# Altium schematic sheet USB Downstream Type C Port 1.SchDoc: DO NOT FILL THIS IN
size Tabloid; Date: DO NOT FILL THIS IN; ApprovedBy: DO NOT FILL THIS IN; CheckedBy: DO NOT FILL THIS IN; Author: DO NOT FILL THIS IN; CompanyName: DO NOT FILL THIS IN; DrawnBy: DO NOT FILL THIS IN; Engineer: DO NOT FILL THIS IN; Organization: DO NOT FILL THIS IN; Address1: DO NOT FILL THIS IN; Address2: DO NOT FILL THIS IN; Address3: DO NOT FILL THIS IN; Address4: DO NOT FILL THIS IN; DocumentNumber: DO NOT FILL THIS IN; Revision: DO NOT FILL THIS IN; SheetNumber: 5; SheetTotal: 9; PageSetup: Record=PageOptions|CenterHorizontal=True|CenterVertical=True|PrintScale=1.00|XCorrection=1.00|YCorrection=1.00|PrintKind=1|BorderSize=5000000|LeftOffset=0|BottomOffset=0|Orientation=2|PaperLength=1000|PaperWidth=1000|Scale=100|PaperSource=7|PrintQuality=-4|MediaType=1|DitherType=10|PaperKind=Ledger|PrintScaleMode=1; cpr-ItemNumber: 025619; cpr-ItemName1: TurtleBot4 UI board; cpr-ItemName2: Rev 2; cpr-Revision: 2; cpr-SheetNumber: 5; cpr-SheetTotal: 9; cpr-Draft: AG; cpr-DraftDate: 19/04/2022; Time: DO NOT FILL THIS IN; ImagePath: DO NOT FILL THIS IN; Application_BuildNumber: DO NOT FILL THIS IN
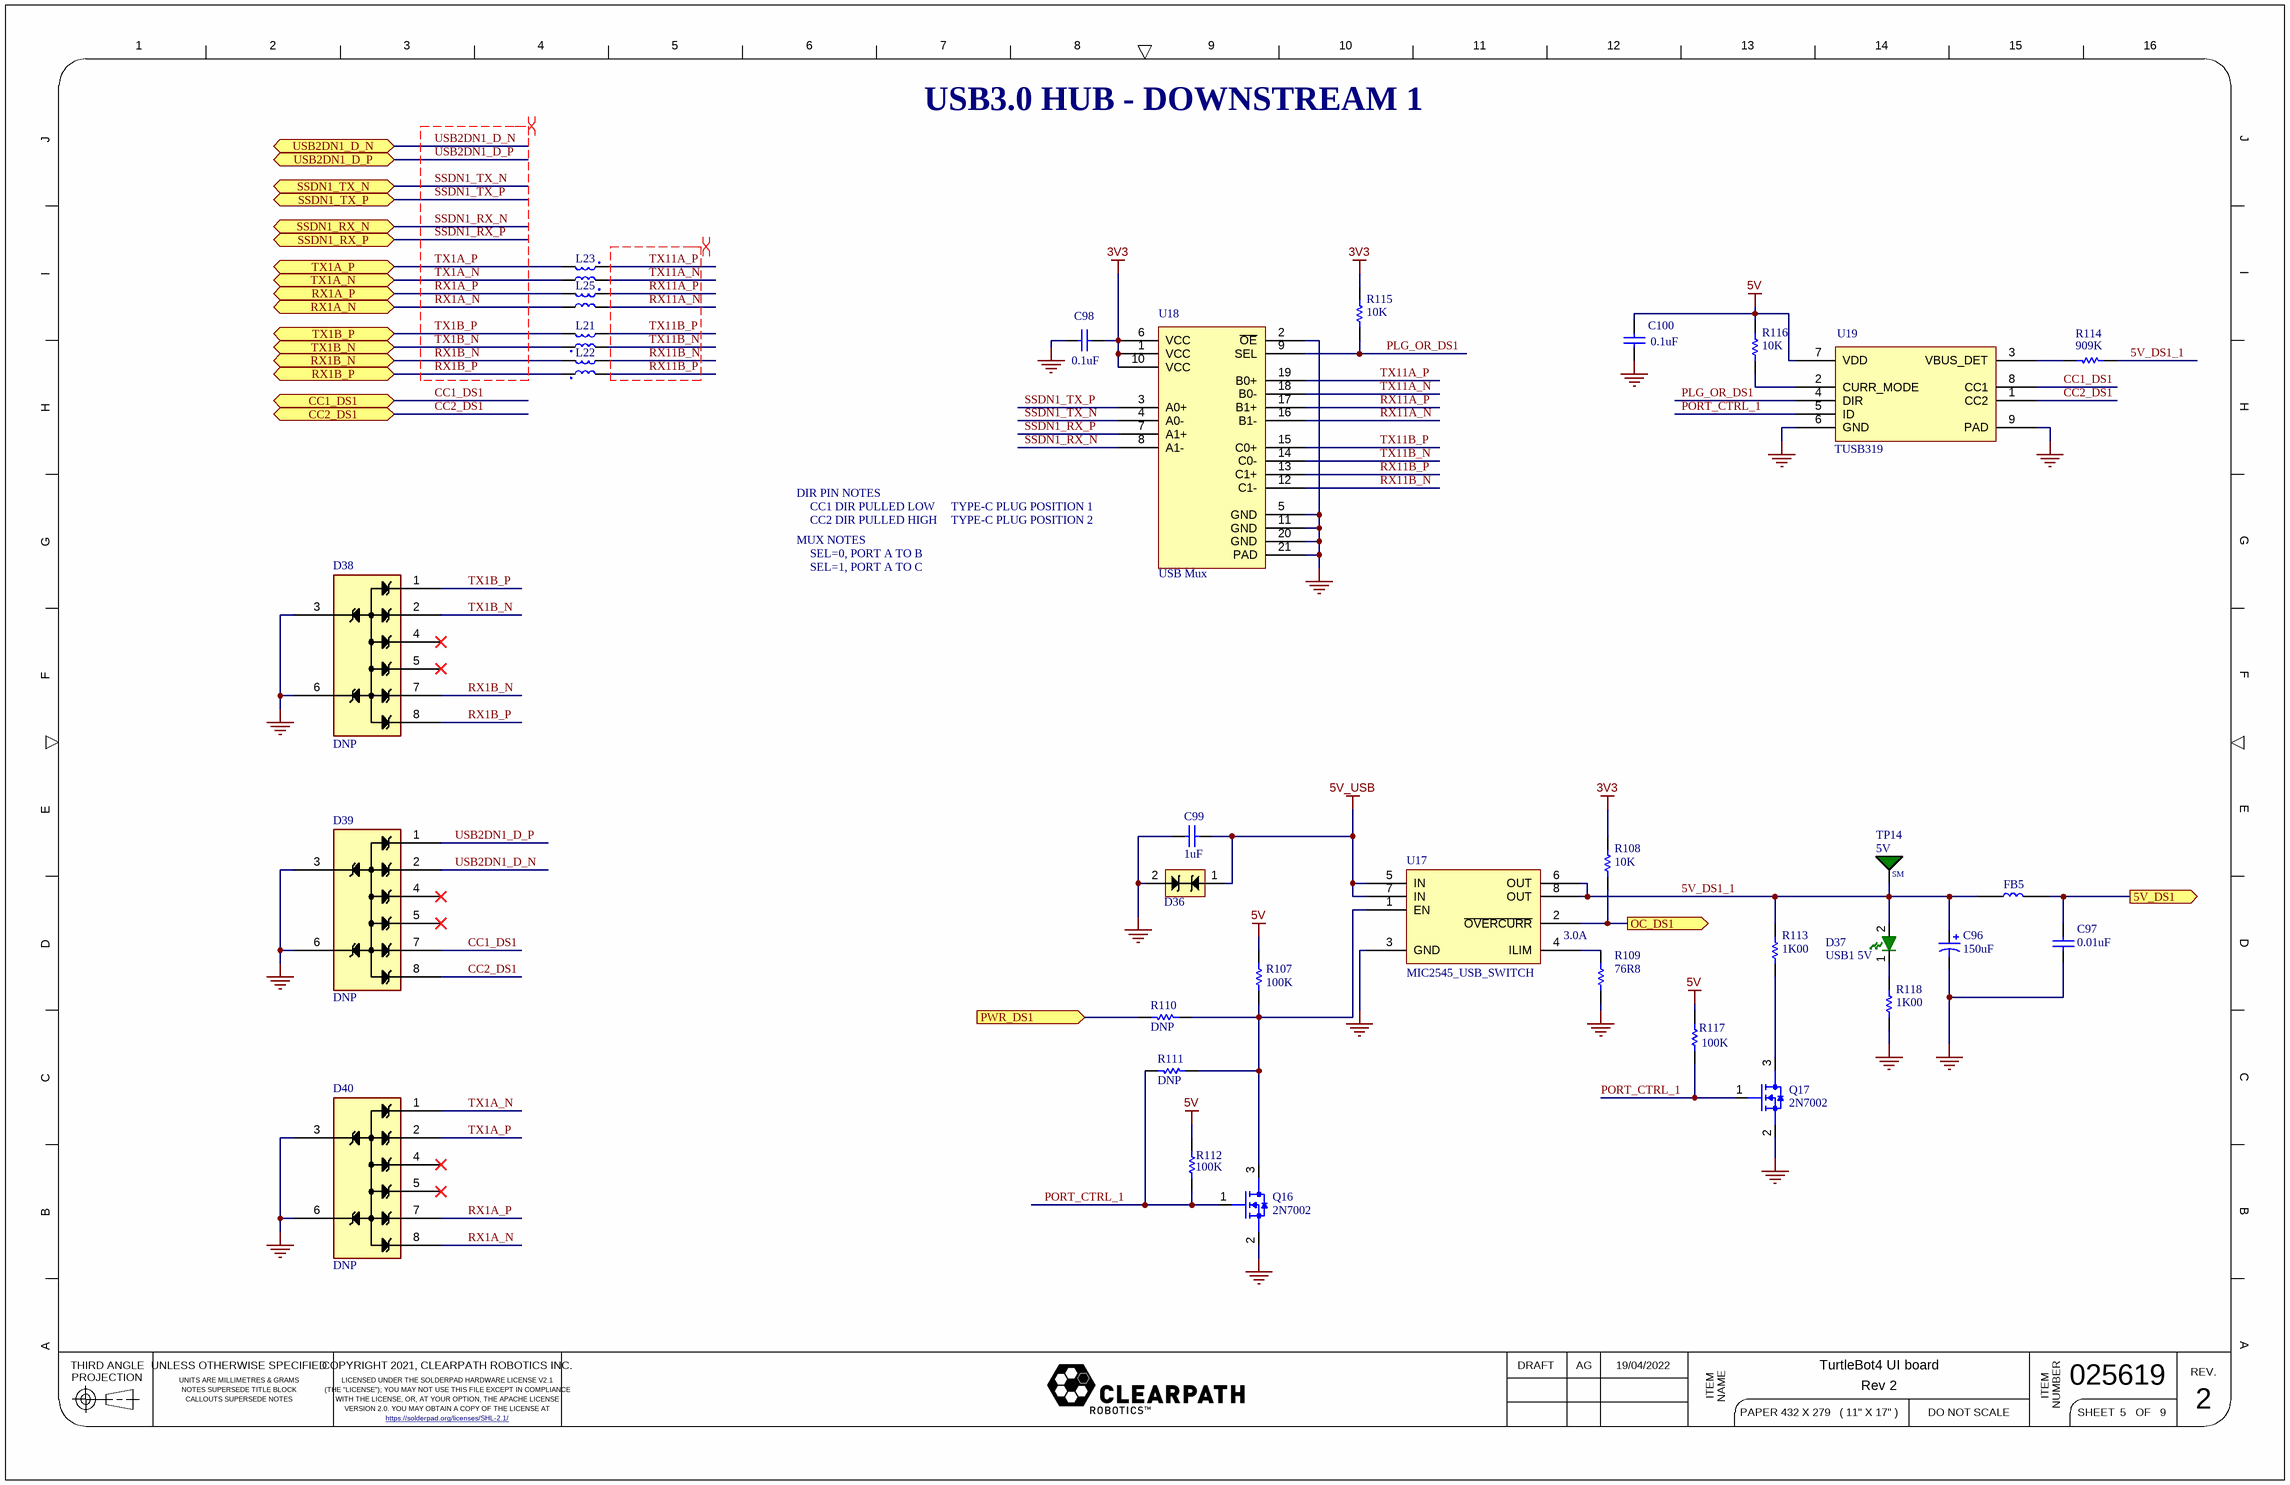
[diagram p0: USB Downstream Type C Port 1.SchDoc]

## Parts
C96  value 150uF  [CAPMP7.6X4.3_3.1N_KEM-M]  (hidden comment: Cap Tant)
C97  value 0.01uF  [C0805]  (hidden comment: Capacitor _SMT)
C98  value 0.1uF  [C0805]  (hidden comment: Capacitor _SMT)
C99  value 1uF  [C0805]  (hidden comment: Capacitor _SMT)
C100  value 0.1uF  [C0805]  (hidden comment: Capacitor _SMT)
D36  TVS DIODE BIDIR 15V SMC  [DO-214AA]  (value not drawn)
D37  USB1 5V  [LED_0805_GRN]
D38  DNP  [ESD7016]
D39  DNP  [ESD7016]
D40  DNP  [ESD7016]
FB5  742792602  [R0603]  (value not drawn)
L21  CMC 100MA 2LN 90 OHM SMD2  [cmc_90_ohms]  (value not drawn)
L22  CMC 100MA 2LN 90 OHM SMD2  [cmc_90_ohms]  (value not drawn)
L23  CMC 100MA 2LN 90 OHM SMD2  [cmc_90_ohms]  (value not drawn)
L25  CMC 100MA 2LN 90 OHM SMD2  [cmc_90_ohms]  (value not drawn)
Q16  Mfg PN: 2N7002  [SOT-23-3]  (hidden comment: NFET)
Q17  Mfg PN: 2N7002  [SOT-23-3]  (hidden comment: NFET)
R107  value 100K  [R0805]  (hidden comment: Resistor_SMT)
R108  value 10K  [R0805]  (hidden comment: Resistor_SMT)
R109  3.0A  value 76R8  [R0805]
R110  value DNP  [R0805]  (hidden comment: Resistor_SMT)
R111  value DNP  [R0805]  (hidden comment: Resistor_SMT)
R112  value 100K  [R0805]  (hidden comment: Resistor_SMT)
R113  value 1K00  [R0805]  (hidden comment: Resistor_SMT)
R114  value 909K  [R0805]  (hidden comment: Resistor_SMT)
R115  value 10K  [R0805]  (hidden comment: Resistor_SMT)
R116  value 10K  [R0805]  (hidden comment: Resistor_SMT)
R117  value 100K  [R0805]  (hidden comment: Resistor_SMT)
R118  value 1K00  [R0805]  (hidden comment: Resistor_SMT)
TP14  5V  [TP_28SM]
U17  MIC2545_USB_SWITCH  [SOIC-8-150]
U18  USB Mux  [TQFN20]
U19  TUSB319  [WSON8]

## Ports
5V_DS1 (out), CC1_DS1 (bidir), CC2_DS1 (bidir), OC_DS1 (out), PWR_DS1 (in), RX1A_N (bidir), RX1A_P (bidir), RX1B_N (bidir), RX1B_P (bidir), SSDN1_RX_N (bidir), SSDN1_RX_P (bidir), SSDN1_TX_N (bidir), SSDN1_TX_P (bidir), TX1A_N (bidir), TX1A_P (bidir), TX1B_N (bidir), TX1B_P (bidir), USB2DN1_D_N (bidir), USB2DN1_D_P (bidir)

## Nets
3V3: C98.1 R108.1 R115.1 U18.1(VCC) U18.6(VCC) U18.10(VCC)
5V: C100.1 R107.2 R112.2 R116.1 R117.2 U19.7(VDD)
5V_USB: C99.2 D36.1 U17.5(IN) U17.7(IN)
GND: C96.2 C97.2 C98.2 C99.1 C100.2 D36.2 D38.3 D38.6 D39.3 D39.6 D40.3 D40.6 Q16.2(D1) Q17.2(D1) R109.1 R118.2 U17.3(GND) U18.2(~{OE}) U18.5(GND) U18.11(GND) U18.20(GND) U18.21(PAD) U19.6(GND) U19.9(PAD)
5V_DS1: C97.1 FB5.2 ; port 5V_DS1
5V_DS1_1: C96.1 D37.2(RA) FB5.1 R113.1 R114.2 TP14.1 U17.6(OUT) U17.8(OUT)
CC1_DS1: D39.7 U19.8(CC1) ; port CC1_DS1
CC2_DS1: D39.8 U19.1(CC2) ; port CC2_DS1
OC_DS1: R108.2 U17.2(~{OVERCURR}) ; port OC_DS1
PLG_OR_DS1: R115.2 U18.9(SEL) U19.4(DIR)
PORT_CTRL_1: Q16.1(G1) Q17.1(G1) R111.1 R112.1 R117.1 U19.5(ID)
PWR_DS1: R110.1 ; port PWR_DS1
RX1A_N: D40.8 L25.3 ; port RX1A_N
RX1A_P: D40.7 L25.4 ; port RX1A_P
RX1B_N: D38.7 L22.2 ; port RX1B_N
RX1B_P: D38.8 L22.1 ; port RX1B_P
RX11A_N: L25.2 U18.16(B1-)
RX11A_P: L25.1 U18.17(B1+)
RX11B_N: L22.3 U18.12(C1-)
RX11B_P: L22.4 U18.13(C1+)
SSDN1_RX_N: U18.8(A1-) ; port SSDN1_RX_N
SSDN1_RX_P: U18.7(A1+) ; port SSDN1_RX_P
SSDN1_TX_N: U18.4(A0-) ; port SSDN1_TX_N
SSDN1_TX_P: U18.3(A0+) ; port SSDN1_TX_P
TX1A_N: D40.1 L23.3 ; port TX1A_N
TX1A_P: D40.2 L23.4 ; port TX1A_P
TX1B_N: D38.2 L21.1 ; port TX1B_N
TX1B_P: D38.1 L21.2 ; port TX1B_P
TX11A_N: L23.2 U18.18(B0-)
TX11A_P: L23.1 U18.19(B0+)
TX11B_N: L21.4 U18.14(C0-)
TX11B_P: L21.3 U18.15(C0+)
USB2DN1_D_N: D39.2 ; port USB2DN1_D_N
USB2DN1_D_P: D39.1 ; port USB2DN1_D_P
NetD37_1: D37.1(RK) R118.1
NetQ16_3: Q16.3(S1) R107.1 R110.2 R111.2 U17.1(EN)
NetQ17_3: Q17.3(S1) R113.2
NetR109_2: R109.2 U17.4(ILIM)
NetR114_1: R114.1 U19.3(VBUS_DET)
NetR116_2: R116.2 U19.2(CURR_MODE)

Not connected (* = marked no-connect by the designer): D38 4* 5*; D39 4* 5*; D40 4* 5*

## Layout directives
differential pair; net class USB3; differential pair class DIFF90; rule Matched Net Lengths [Tolerance = 15mil]: RX1A_N, RX1A_P, RX1B_N, RX1B_P, RX11A_N, RX11A_P, RX11B_N, RX11B_P, SSDN1_RX_N, SSDN1_RX_P, SSDN1_TX_N, SSDN1_TX_P, TX1A_N, TX1A_P, TX1B_N, TX1B_P, TX11A_N, TX11A_P, TX11B_N, TX11B_P, USB2DN1_D_N, USB2DN1_D_P

## Notes on the sheet
- USB3.0 HUB - DOWNSTREAM 1
- DIR PIN NOTES
- MUX NOTES
- CC1 DIR PULLED LOW
- CC2 DIR PULLED HIGH
- SEL=0, PORT A TO B
- SEL=1, PORT A TO C
- TYPE-C PLUG POSITION 1
- TYPE-C PLUG POSITION 2
- 1
- 2
- 3
- 4
- 5
- 6
- 7
- 8
- 9
- 10
- 11
- 12
- 13
- 14
- 15
- 16
- J
- I
- H
- G
- F
- E
- D
- C
- B
- A
- THIRD ANGLE
- PROJECTION
- UNLESS OTHERWISE SPECIFIED
- COPYRIGHT 2021, CLEARPATH ROBOTICS INC.
- DRAFT
- REV.
- UNITS ARE MILLIMETRES & GRAMS
- NOTES SUPERSEDE TITLE BLOCK
- CALLOUTS SUPERSEDE NOTES
- LICENSED UNDER THE SOLDERPAD HARDWARE LICENSE V2.1
- (THE "LICENSE"); YOU MAY NOT USE THIS FILE EXCEPT IN COMPLIANCE
- WITH THE LICENSE, OR, AT YOUR OPTION, THE APACHE LICENSE
- VERSION 2.0. YOU MAY OBTAIN A COPY OF THE LICENSE AT
- https://solderpad.org/licenses/SHL-2.1/ <https://solderpad.https://solderpad.org/licenses/SHL-2.1/org/licenses/SHL-2.1/>
- ITEM
- NAME
- PAPER 432 X 279   ( 11" X 17" )
- DO NOT SCALE
- NUMBER
- SHEET
- OF
- (in symbol TP_28SM) SM

## Library data of the parts
C96 = Cap Pol1: CAP TANT 150UF 10% 16V 2917; Vendor: Digikey; Mfg PN: 293D157X9016D2TE3; Vendor PN: 718-1746-1-ND; Mfg: Vishay Sprague; Voltage: 16V; Tolerance: 10%; Package: 2917; Supplier 1: Digi-Key; Supplier Part Number 1: 718-1746-1-ND
C97 = Capacitor _SMT: Capacitor; Tolerance: 10%; Voltage: 50V; Vendor: Digikey; Vendor PN: 1276-CL10B103KB8WPNDCT-ND; Mfg: Samsung Electro-Mechanics; Mfg PN: CL10B103KB8WPND; DNP: *; Package: 0603; Supplier 1: Digi-Key; Supplier Part Number 1: 1276-CL10B103KB8WPNDCT-ND
C98 C100 = Capacitor _SMT: Capacitor; Tolerance: 10%; Voltage: 50V; Vendor: Digikey; Vendor PN: 311-1140-1-ND; Mfg: Yageo; Mfg PN: CC0805KRX7R9BB104; DNP: *; Package: 0805
C99 = Capacitor _SMT: Capacitor; Tolerance: -20 +80; Voltage: 50V; Vendor: Digikey; Vendor PN: 311-1909-1-ND; Mfg: Yageo; Mfg PN: CC0805ZKY5V9BB105; DNP: *; Package: 0805
D36 = TVS DIODE BIDIR 15V SMC: TVS 600W 15V BI-DIR DO-214AA; Vendor: Digikey; Vendor PN: 18-SMA6J5.0CACT-ND; Mfg: Littelfuse Inc.; Mfg PN: SMA6J5.0CA; Package: DO214AC; Supplier 1: Digi-Key; Supplier Part Number 1: 18-SMA6J5.0CACT-ND
D37 = GREEN_LED: Green LED; Vendor: Digikey; Mfg PN: LTST-C170KGKT; Mfg: LiteOn; Vendor 1: 160-1414-1-ND; Package: 0805
D38-D40 = ESD7016: USB3 TVS diode assy; Vendor 1: Digikey; Vendor 1 PN: ESD7016MUTAGOSCT-ND; Mfg: ON Semi; Mfg PN: ESD7016MUTAG; Vendor 2 PN: *; Vendor 2: *
FB5 = 742792602: 60 Ohms 1 Signal Line Ferrite Bead 0603 (1608 Metric) 3A 40mOhm; Supplier 1: Digi-Key; Supplier Part Number 1: 732-4660-1-ND
L21-L23 L25 = CMC 90_Ohms: Line Common Mode Choke Surface Mount 90 Ohms 100mA DCR 5Ohm; Supplier 1: Digi-Key; Supplier Part Number 1: 490-16595-1-ND
Q16 Q17 = NFET_SNGL: Vendor: Digikey; Vendor PN: 2N7002NCT-ND; Mfg: ON Semi; Package: SOT23-3
R107 R112 R117 = Resistor_SMT: Resistor; Vendor: Digikey; Vendor PN: 311-100KCRCT-ND; Tolerance: 1%; Mfg: Yageo; Mfg PN: RC0805FR-07100KL; Power Rating: *; Package: 0805
R108 R115 R116 = Resistor_SMT: Resistor; Vendor: Digikey; Vendor PN: 311-10.0KCRCT-ND; Tolerance: 1%; Mfg: Yageo; Mfg PN: RC0805FR-0710KL; Power Rating: *; Package: 0805
  R108: Supplier 1: Digi-Key; Supplier Part Number 1: 311-10.0KCRTR-ND
R109 = Resistor_SMT: Resistor; Vendor: Digikey; Vendor PN: 311-76.8CRCT-ND; Tolerance: 1%; Mfg: Yageo; Mfg PN: RC0805FR-0776R8L; Power Rating: *; Package: 0805
R110 R111 = Resistor_SMT: Resistor; Vendor: Digikey; Vendor PN: 311-0.0ARCT-ND; Mfg: Yageo; Mfg PN: RC0805JR-070RL; Power Rating: *; Package: 0805
R113 R118 = Resistor_SMT: Resistor; Vendor: Digikey; Vendor PN: 311-1.00KCRCT-ND; Tolerance: 1%; Mfg: Yageo; Mfg PN: RC0805FR-071KL; Power Rating: *; Package: 0805
R114 = Resistor_SMT: Resistor; Vendor: Digikey; Vendor PN: 311-909KCRCT-ND; Tolerance: 1%; Mfg: Yageo; Mfg PN: RC0805FR-07909KL; Power Rating: *; Package: 0805
TP14 = TP_28SM: Test point, 28 Mil exposed pad; Manufacturer: Clearpath Robotics Inc.; ID: 1; PCB Component: TP_28SM; Status: Draft; Vendor: Clearpath Robotics Inc.; Vendor PN: TP_28SM; Type: SM Pad; Features: Exposed 28mil pad; Octopart Link: N/A
U17 = MIC2545_USB_SWITCH: IC PWR SWITCH N-CHAN 1:1 8SOIC; Vendor PN: MIC2545A-1YM-CT-ND; Vendor: Digikey; Mfg PN: MIC2545A-1YM-TR; Mfg: Microchip; Package: SOIC8
U18 = TC7PCI3212: TC7PCI3212MT,LF USB3.0 Mux; Manufacturer: Toshiba; Vendor 1 PN: 757-TC7PCI3212MTLF; Vendor 1: Mouser; Package: TQFN-20; Mfg PN: TC7PCI3212MT,LF
U19 = TUSB319: USB Type C Controller; Vendor 1 PN: 595-TUSB319IDRFRQ1; Vendor 1: Mouser; Mfg PN: TUSB319IDRFRQ1; Mfg: Texas Instruments; Package: WSON8